# Altium project LM35.PrjPcb
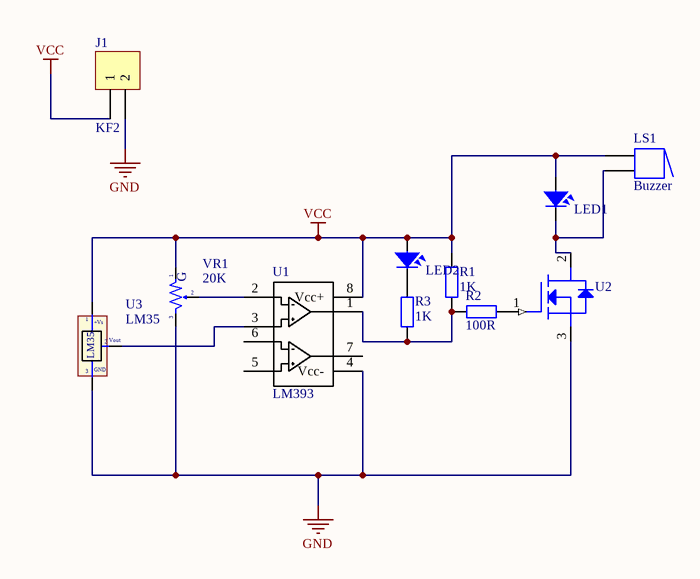
[diagram p0: Sheet1.SchDoc]
1 sheet, 11 parts. Net scope: global (net labels, ports and power ports of the same name join across sheets).
Board file: PCB1.PcbDoc

## Sheet Sheet1.SchDoc
size A

### Parts
J1  KF2  [KF2-3.5]
LED1  LED  [LED-5MM-RED]  (value not drawn)
LED2  LED  [LED-5MM-GREEN]  (value not drawn)
LS1  Buzzer  [Buzzer]
R1  1K  [R1/4W]
R2  100R  [R1/4W]
R3  1K  [R1/4W]
U1  LM393  [DIP8]
U2  IRF540_1  [TO-220N]  (value not drawn)
U3  LM35  [TO92-123]
VR1  20K  [VR-S2]

### Nets
GND: J1.2 U1.4(Vcc-) U2.3(S) U3.3(-) VR1.3
VCC: J1.1 LED1.1 LED2.1 LS1.1 R1.2 U1.8(Vcc+) U3.1(+Vs) VR1.1
NetLED1_2: LED1.2 LS1.2 U2.2(D)
NetLED2_2: LED2.2 R3.1
NetR1_1: R1.1 R2.1 R3.2 U1.1
NetR2_2: R2.2 U2.1(G)
NetU1_2: U1.2 VR1.2
NetU1_3: U1.3 U3.2(Vout)

Not connected (* = marked no-connect by the designer): U1 5 6 7

### Notes on the sheet
- (in symbol LM35) GND
- (in symbol VR-S) G

### Library data of the parts
J1 = KF2: Manufacturer: Würth Elektronik eiSos GmbH; partNo: 691103110002; ComponentLink1 Description: Manufacturer; ComponentLink2 Description: Datasheet; NoPins: 2; Created Date: 29 October 2013; ComponentLink1URL: http://www.we-online.com; ComponentLink2URL: http://katalog.we-online.de/em/datasheet/6911031100xx.pdf; Created by: Karrer Zheng
LED1 LED2 = LED: LED Single colour Green and Red; Value: LED 3 ly Single Colour
LS1 = Buzzer: Magnetic Transducer Buzzer; Published: 24-Mar-1999; LatestRevisionDate: 17-Dec-2003; LatestRevisionNote: Schematic revised, PCB Footprint replaced.; DatasheetDocument: 17-Dec-2003; PackageReference: ABSM-1574; Publisher: Altium Limited; ComponentLink1Description: Manufacturer Link; ComponentLink1URL: http://www.megastar.com/linecard/buzzmode/index.php
R1-R3 = R1/4W: Resistor 1/4W; Value: R1/4W - 1K
U1 = LM393: IC DUAL COMPARATOR
U2 = IRF540_1: IRF9540 - N-CHANNEL POWER MOSFETS; Vendor: Digikey; Publisher: Hoang Nguyen; Price: 7.000 VND; ComponentLink2Description: Open Datasheet; ComponentLink2URL: H:\LIBRARY\LIBRARY.Datasheet\IRF540.pdf; Published: 13-April-2009; ComponentLink1Description: Digikey Part Link
U3 = LM35: Teminal; Value: LM35
VR1 = VR-S: Var Resistor; Value: Volume 50k